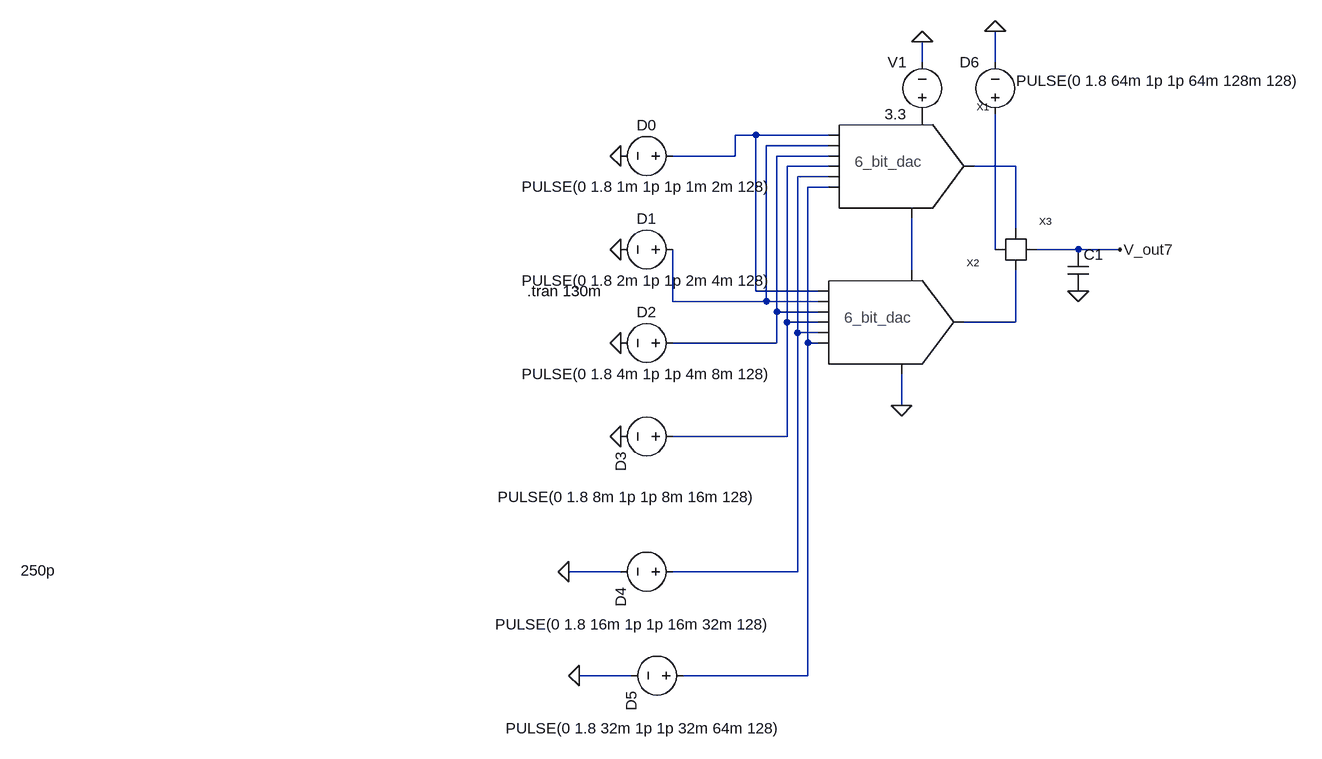
[diagram p0: schematic 7_bit_dac.asc]
7_bit_dac.asc, the LTspice schematic file:
Version 4
SHEET 1 880 996
WIRE 288 -48 288 -80
WIRE 400 -48 400 -96
WIRE 32 64 0 64
WIRE 144 64 32 64
WIRE 144 80 48 80
WIRE 0 96 0 64
WIRE 0 96 -96 96
WIRE 144 96 64 96
WIRE 144 112 80 112
WIRE 432 112 368 112
WIRE 144 128 96 128
WIRE 144 144 112 144
WIRE 432 208 432 112
WIRE 400 240 400 32
WIRE 528 240 464 240
WIRE 592 240 528 240
WIRE 272 272 272 192
WIRE 32 304 32 64
WIRE 128 304 32 304
WIRE -96 320 -96 240
WIRE 48 320 48 80
WIRE 48 320 -96 320
WIRE 128 320 48 320
WIRE 64 336 64 96
WIRE 128 336 64 336
WIRE 80 352 80 112
WIRE 128 352 80 352
WIRE 432 352 432 272
WIRE 432 352 352 352
WIRE 96 368 96 128
WIRE 128 368 96 368
WIRE 64 384 64 336
WIRE 64 384 -96 384
WIRE 112 384 112 144
WIRE 128 384 112 384
WIRE 256 480 256 432
WIRE 80 528 80 352
WIRE 80 528 -96 528
WIRE -176 736 -256 736
WIRE 96 736 96 368
WIRE 96 736 -96 736
WIRE -160 896 -240 896
WIRE 112 896 112 384
WIRE 112 896 -80 896
FLAG -176 96 0
FLAG -176 240 0
FLAG -176 528 0
FLAG -176 384 0
FLAG -256 736 0
FLAG 288 -80 0
FLAG 256 480 0
FLAG 400 -96 0
FLAG 592 240 V_out7
FLAG -240 896 0
FLAG 528 304 0
SYMBOL switch 432 240 R0
SYMATTR InstName X3
SYMBOL voltage -80 96 R90
WINDOW 0 -32 56 VBottom 2
WINDOW 3 32 56 VTop 2
WINDOW 123 0 0 Left 0
WINDOW 39 0 0 Left 0
SYMATTR InstName D0
SYMATTR Value PULSE(0 1.8 1m 1p 1p 1m 2m 128)
SYMBOL voltage -80 240 R90
WINDOW 0 -32 56 VBottom 2
WINDOW 3 32 56 VTop 2
WINDOW 123 0 0 Left 0
WINDOW 39 0 0 Left 0
SYMATTR InstName D1
SYMATTR Value PULSE(0 1.8 2m 1p 1p 2m 4m 128)
SYMBOL voltage -80 528 R90
WINDOW 0 24 96 Left 2
WINDOW 3 93 -113 VRight 2
WINDOW 123 0 0 Left 0
WINDOW 39 0 0 Left 0
SYMATTR InstName D3
SYMATTR Value PULSE(0 1.8 8m 1p 1p 8m 16m 128)
SYMBOL voltage -80 384 R90
WINDOW 0 -32 56 VBottom 2
WINDOW 3 32 56 VTop 2
WINDOW 123 0 0 Left 0
WINDOW 39 0 0 Left 0
SYMATTR InstName D2
SYMATTR Value PULSE(0 1.8 4m 1p 1p 4m 8m 128)
SYMBOL voltage -80 736 R90
WINDOW 0 24 96 Left 2
WINDOW 3 81 289 VLeft 2
WINDOW 123 0 0 Left 0
WINDOW 39 0 0 Left 0
SYMATTR InstName D4
SYMATTR Value PULSE(0 1.8 16m 1p 1p 16m 32m 128)
SYMBOL voltage 288 48 R180
WINDOW 0 24 96 Left 2
WINDOW 3 24 16 Left 2
WINDOW 123 0 0 Left 0
WINDOW 39 0 0 Left 0
SYMATTR InstName V1
SYMATTR Value 3.3
SYMBOL voltage 400 48 R180
WINDOW 0 24 96 Left 2
WINDOW 3 -471 68 Left 2
WINDOW 123 0 0 Left 0
WINDOW 39 0 0 Left 0
SYMATTR InstName D6
SYMATTR Value PULSE(0 1.8 64m 1p 1p 64m 128m 128)
SYMBOL 6_bit_dac 240 112 R0
SYMATTR InstName X1
SYMBOL 6_bit_dac 224 352 R0
SYMATTR InstName X2
SYMBOL voltage -64 896 R90
WINDOW 0 24 96 Left 2
WINDOW 3 81 289 VLeft 2
WINDOW 123 0 0 Left 0
WINDOW 39 0 0 Left 0
SYMATTR InstName D5
SYMATTR Value PULSE(0 1.8 32m 1p 1p 32m 64m 128)
SYMBOL cap 512 240 R0
WINDOW 3 -1611 494 Left 2
SYMATTR Value 250p
SYMATTR InstName C1
TEXT -320 304 Left 2 !.tran 130m

The netlist it stands for:
* 7_bit_dac.asc
XX3 N008 N005 N010 V_out7 switch  ; pins digital_input Vin_1 Vin_2 Vout
V§D0 N001 0 PULSE(0 1.8 1m 1p 1p 1m 2m 128)
V§D1 N002 0 PULSE(0 1.8 2m 1p 1p 2m 4m 128)
V§D3 N004 0 PULSE(0 1.8 8m 1p 1p 8m 16m 128)
V§D2 N003 0 PULSE(0 1.8 4m 1p 1p 4m 8m 128)
V§D4 N006 0 PULSE(0 1.8 16m 1p 1p 16m 32m 128)
V1 P001 0 3.3
V§D6 N008 0 PULSE(0 1.8 64m 1p 1p 64m 128m 128)
XX1 N001 N002 N003 N004 N006 N007 N005 P001 N009 6_bit_dac  ; pins D0 D1 D2 D3 D4 D5 V_out6 R_in6 R_out6
XX2 N001 N002 N003 N004 N006 N007 N010 N009 0 6_bit_dac  ; pins D0 D1 D2 D3 D4 D5 V_out6 R_in6 R_out6
V§D5 N007 0 PULSE(0 1.8 32m 1p 1p 32m 64m 128)
C1 V_out7 0 250p
.tran 130m
.backanno
.end